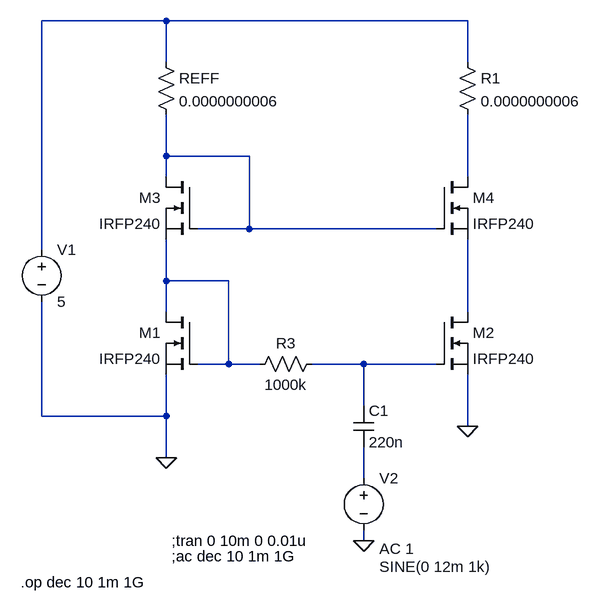
[diagram p0: schematic Current Mirror.asc]
Current Mirror.asc, the LTspice schematic file:
Version 4
SHEET 1 1020 680
WIRE 336 -224 144 -224
WIRE 800 -224 336 -224
WIRE 336 -160 336 -224
WIRE 800 -160 800 -224
WIRE 336 -16 336 -80
WIRE 464 -16 336 -16
WIRE 336 16 336 -16
WIRE 800 16 800 -80
WIRE 464 96 464 -16
WIRE 464 96 384 96
WIRE 752 96 464 96
WIRE 144 128 144 -224
WIRE 336 176 336 112
WIRE 432 176 336 176
WIRE 336 224 336 176
WIRE 800 224 800 112
WIRE 432 304 432 176
WIRE 432 304 384 304
WIRE 480 304 432 304
WIRE 640 304 560 304
WIRE 752 304 640 304
WIRE 640 368 640 304
WIRE 144 384 144 208
WIRE 336 384 336 320
WIRE 336 384 144 384
WIRE 800 400 800 320
WIRE 336 448 336 384
WIRE 640 480 640 432
WIRE 640 576 640 560
FLAG 800 400 0
FLAG 640 576 0
FLAG 336 448 0
SYMBOL voltage 144 112 R0
SYMATTR InstName V1
SYMATTR Value 5
SYMBOL res 320 -176 R0
SYMATTR InstName REFF
SYMATTR Value 0.0000000006
SYMBOL res 784 -176 R0
SYMATTR InstName R1
SYMATTR Value 0.0000000006
SYMBOL nmos 384 16 M0
SYMATTR InstName M3
SYMATTR Value IRFP240
SYMBOL nmos 384 224 M0
SYMATTR InstName M1
SYMATTR Value IRFP240
SYMBOL nmos 752 16 R0
SYMATTR InstName M4
SYMATTR Value IRFP240
SYMBOL nmos 752 224 R0
SYMATTR InstName M2
SYMATTR Value IRFP240
SYMBOL res 576 288 R90
WINDOW 0 0 56 VBottom 2
WINDOW 3 32 56 VTop 2
SYMATTR InstName R3
SYMATTR Value 1000k
SYMBOL cap 624 368 R0
SYMATTR InstName C1
SYMATTR Value 220n
SYMBOL voltage 640 464 R0
WINDOW 3 24 152 Left 2
WINDOW 123 24 124 Left 2
WINDOW 39 0 0 Left 0
SYMATTR Value SINE(0 12m 1k)
SYMATTR Value2 AC 1
SYMATTR InstName V2
TEXT 344 600 Left 2 !;ac dec 10 1m 1G
TEXT 344 576 Left 2 !;tran 0 10m 0 0.01u
TEXT 112 640 Left 2 !.op dec 10 1m 1G

The netlist it stands for:
* Current Mirror.asc
V1 N001 0 5
REFF N001 N002 0.0000000006
R1 N001 N003 0.0000000006
M3 N002 N002 N004 N004 IRFP240
M1 N004 N004 0 0 IRFP240
M4 N003 N002 N005 N005 IRFP240
M2 N005 N006 0 0 IRFP240
R3 N006 N004 1000k
C1 N006 N007 220n
V2 N007 0 SINE(0 12m 1k) AC 1
.model NMOS NMOS
.model PMOS PMOS
.lib standard.mos
;ac dec 10 1m 1G
;tran 0 10m 0 0.01u
.op dec 10 1m 1G
.backanno
.end